# EAGLE design hothouse-io-no-branding (EAGLE 9.6.2)
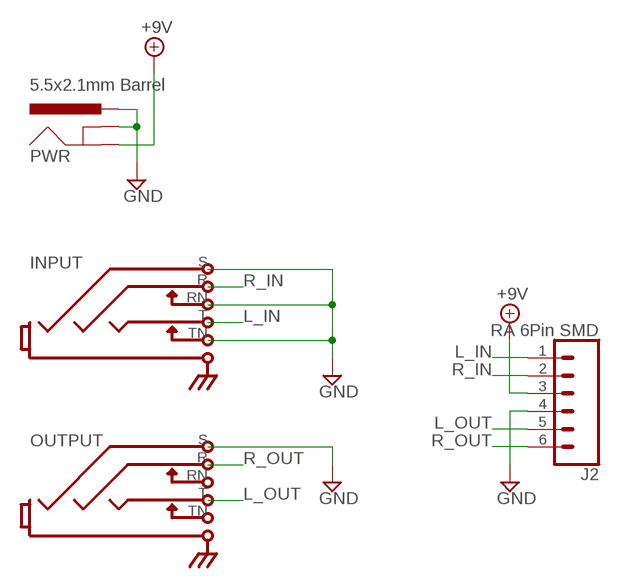
[diagram p0: schematic, sheet 1]

## Parts
INPUT  STEREOSW2GND  [NEUTRIK-NRJ6HM-1]
J2  RA 6Pin SMD  CONN_06SILK_FEMALE_PTH  [1X06]
OUTPUT  STEREOSW2GND  [NEUTRIK-NRJ6HM-1]
PWR  5.5x2.1mm Barrel  POWER_JACKPOWER_JACK_SLOT  [POWER_JACK_PTH_SLOT]

## Nets
+9V: J2.3 PWR.GND
GND: INPUT.RN INPUT.S INPUT.TN J2.4 OUTPUT.S PWR.GNDBREAK PWR.PWR
L_IN: INPUT.T J2.1
L_OUT: J2.5 OUTPUT.T
R_IN: INPUT.R J2.2
R_OUT: J2.6 OUTPUT.R
Unconnected: OUTPUT.RN OUTPUT.TN

## Library data of the parts
INPUT OUTPUT = hothouse-io-no-branding:STEREOSW2GND: 1/4" stereo jack, switched (unswitched sleeve), with chassis ground connection
J2 = hothouse-io-no-branding:CONN_06: Multi connection point. Often used as Generic Header-pin footprint for 0.1 inch spaced/style header connections On any of the 0.1 inch spaced packages, you can populate with these: Break Away Headers - Straight <https://www.sparkfun.com/products/116> (PRT-00116) Break Away Male Headers - Right Angle <https://www.sparkfun.com/products/553> (PRT-00553) Female Headers <https://www.sparkfun.com/products/115> (PRT-00115) Break Away Headers - Machine Pin <https://www.sparkfun.com/products/117> (PRT-00117) Break Away Female Headers - Swiss Machine Pin <https://www.sparkfun.com/products/743> (PRT-00743) Arduino Stackable Header - 6 Pin <https://www.sparkfun.com/products/9280> (PRT-09280) For SCREWTERMINALS and SPRING TERMINALS visit here: Screw Terimnals on SparkFun.com <https://www.sparkfun.com/search/results?term=Screw+Terminals> (5mm/3.5mm/2.54mm spacing) This device is also useful as a general connection point to wire up your design to another part of your project. Our various solder wires solder well into these plated through hole pads. Hook-Up Wire - Assortment (Stranded, 22 AWG) <https://www.sparkfun.com/products/11375> (PRT-11375) Hook-Up Wire - Assortment (Solid Core, 22 AWG) <https://www.sparkfun.com/products/11367> (PRT-11367) View the entire wire category on our website here <https://www.sparkfun.com/categories/141>; PROD_ID: CONN-11293; SF_ID: GPS-00579
PWR = hothouse-io-no-branding:POWER_JACK: Power Jack Connector This is the standard 5.5mm barrel jack for power. The PTH is the most common, proven, reliable, footprint. The Slot footprint only works if the mill layer is transmitted to the PCB fab house so be warned. Here are the connectors we sell at SparkFun: DC Barrel Power Jack/Connector <https://www.sparkfun.com/products/119> (PRT-00119) DC Barrel Power Jack/Connector (SMD) <https://www.sparkfun.com/products/12748> (PRT-12748) DC Barrel Jack Adapter - Breadboard Compatible <https://www.sparkfun.com/products/10811> (PRT-10811) It is used on this SparkFun product (and many, many others): SparkFun RedBoard - Programmed with Arduino <https://www.sparkfun.com/products/12757> (DEV-12757) Also, if you need a mating power supply or connector, please check these out: Wall Adapter Power Supply - 9VDC 650mA <https://www.sparkfun.com/products/298> (TOL-00298) DC Barrel Jack Adapter - Male <https://www.sparkfun.com/products/10287> (PRT-10287); PROD_ID: CONN-08106; SF_ID: PRT-12748

## Board
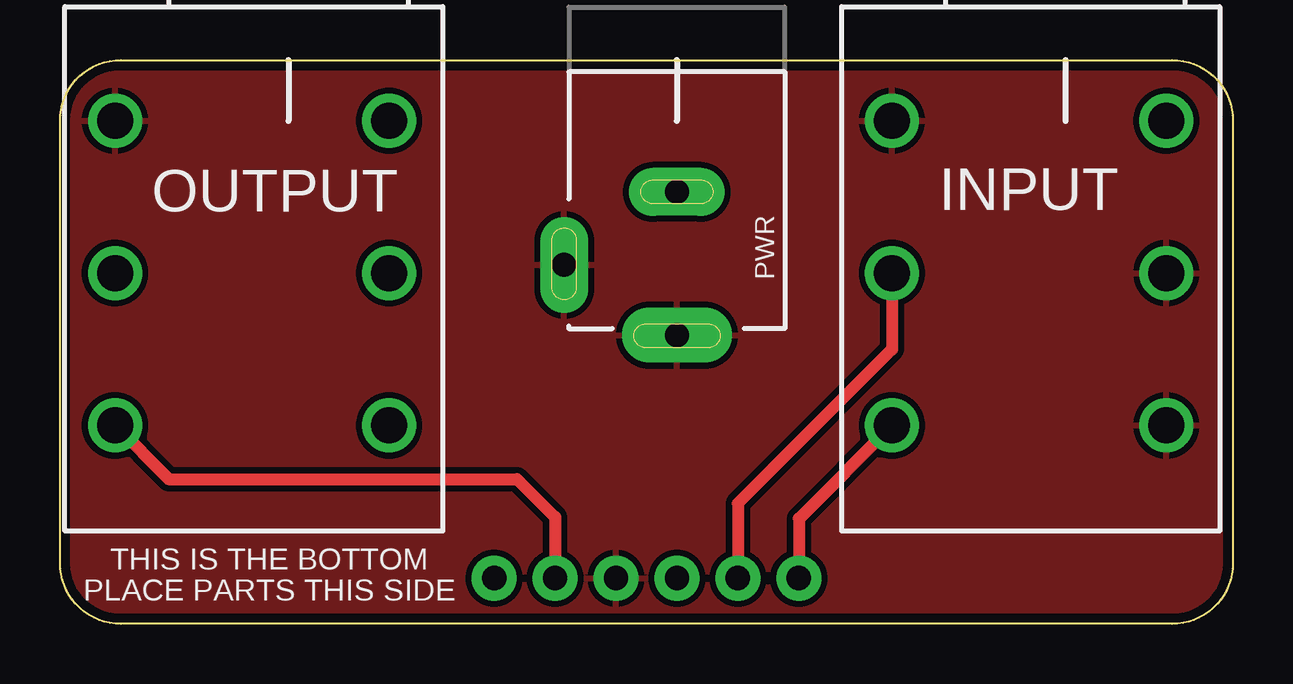
[diagram p1: board, top side]
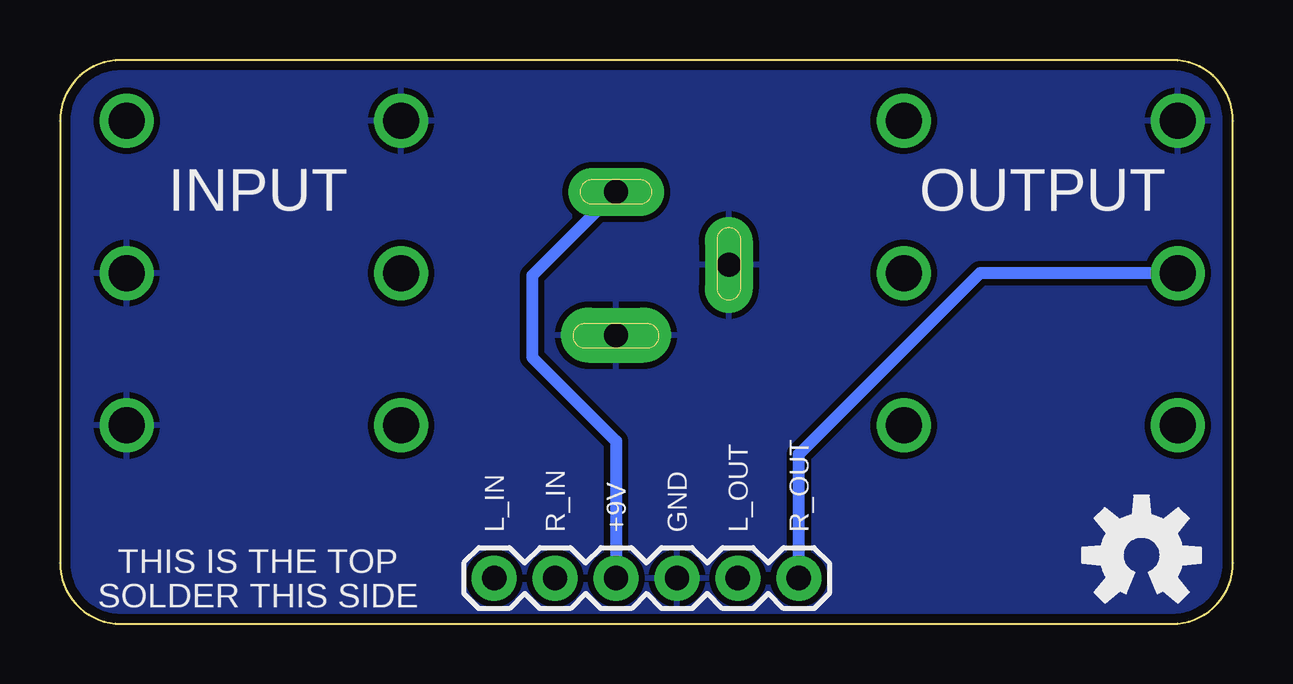
[diagram p2: board, bottom side, seen from below]

Size 48.9 x 23.5 mm. Coordinates in mm from the lower left corner, seen from the top.
Outline: 48.9,20.95 48.9,2.54 arc-90 46.35,0 2.54,0 arc-90 0,2.54 0,20.95 arc-90 2.54,23.5 46.35,23.5 arc-90 48.9,20.95
Copper layers (1*16): Top 0.035559375mm / dielectric 1.6mm / Bottom 0.035559375mm
Design rules "oshpark-2layer-tented": minimum track width 6mil, minimum drill 10mil, track to track 6mil, track to pad 6mil, pad to pad 6mil, via to via 6mil, smd to smd 6mil, copper to edge 15mil, drill to drill 6mil, minimum pad ring 5mil, minimum via ring 5mil, stop-mask expansion 2.5mil, vias tented up to drill 20mil, thermal gap 10mil

### Footprints (pad centres in the part's own frame; a part is rotated, then mirrored left to right if it is on the bottom)
NEUTRIK-NRJ6HM-1 = drill 1.5: R 7.23,11.1; RN -4.2,11.1; S 7.23,4.75; SN -4.2,4.75; T 7.23,17.45; TN -4.2,17.45
1X06 = drill 1.016 pad 1.88: 1 0,0; 2 2.54,0; 3 5.08,0; 4 7.62,0; 5 10.16,0; 6 12.7,0
POWER_JACK_PTH_SLOT = drill 1 pad 2 long: GND 0,0; GNDBREAK -3.048,4.699 | drill 1 pad 2.3 long: PWR -5.969,0

### Placement (x,y rotation side)
INPUT  41.91,25.72 180 top
J2  30.8,1.91 0 bottom
OUTPUT  9.53,25.72 180 top
PWR  25.72,18 90 top
U$1  [OSHW-LOGO-M]  3.81,2.86 0 bottom

### Tracks (layer width: path | path; a pad name or v marks a point on that pad's centre or on a via)
+9V
  Bottom 0.508: PWR.GND 29.21,14.51 29.21,11.11 25.72,7.62 J2.3
GND
  pour Top (isolate 0.254): 0,10.48 0,20.95 arc-90 2.54,23.5 33.97,23.5 46.35,23.5 arc-90 48.9,20.95 48.9,5.71 48.9,2.54 arc-90 46.35,0 12.7,0 2.54,0 arc-90 0,2.54
  pour Bottom (isolate 0.254): 0,12.7 0,20.95 arc-90 2.54,23.5 26.35,23.5 46.35,23.5 arc-90 48.9,20.95 48.9,5.71 48.9,2.54 arc-90 46.35,0 20.32,0 2.54,0 arc-90 0,2.54
L_IN
  Top 0.508: INPUT.T 30.8,4.38 J2.1
L_OUT
  Top 0.508: OUTPUT.T 4.53,6.03 19.05,6.03 20.64,4.45 J2.5
R_IN
  Top 0.508: INPUT.R 34.68,11.44 28.26,5.02 J2.2
R_OUT
  Bottom 0.508: J2.6 18.1,7.07 10.55,14.62 OUTPUT.R

### Text on the board
tPlace: THIS IS THE BOTTOM / PLACE PARTS THIS SIDE
bPlace: OUTPUT | INPUT | R_OUT | L_OUT | GND | +9V | R_IN | L_IN | THIS IS THE TOP / SOLDER THIS SIDE